# Altium project BatteryIot-V3.PrjPcb
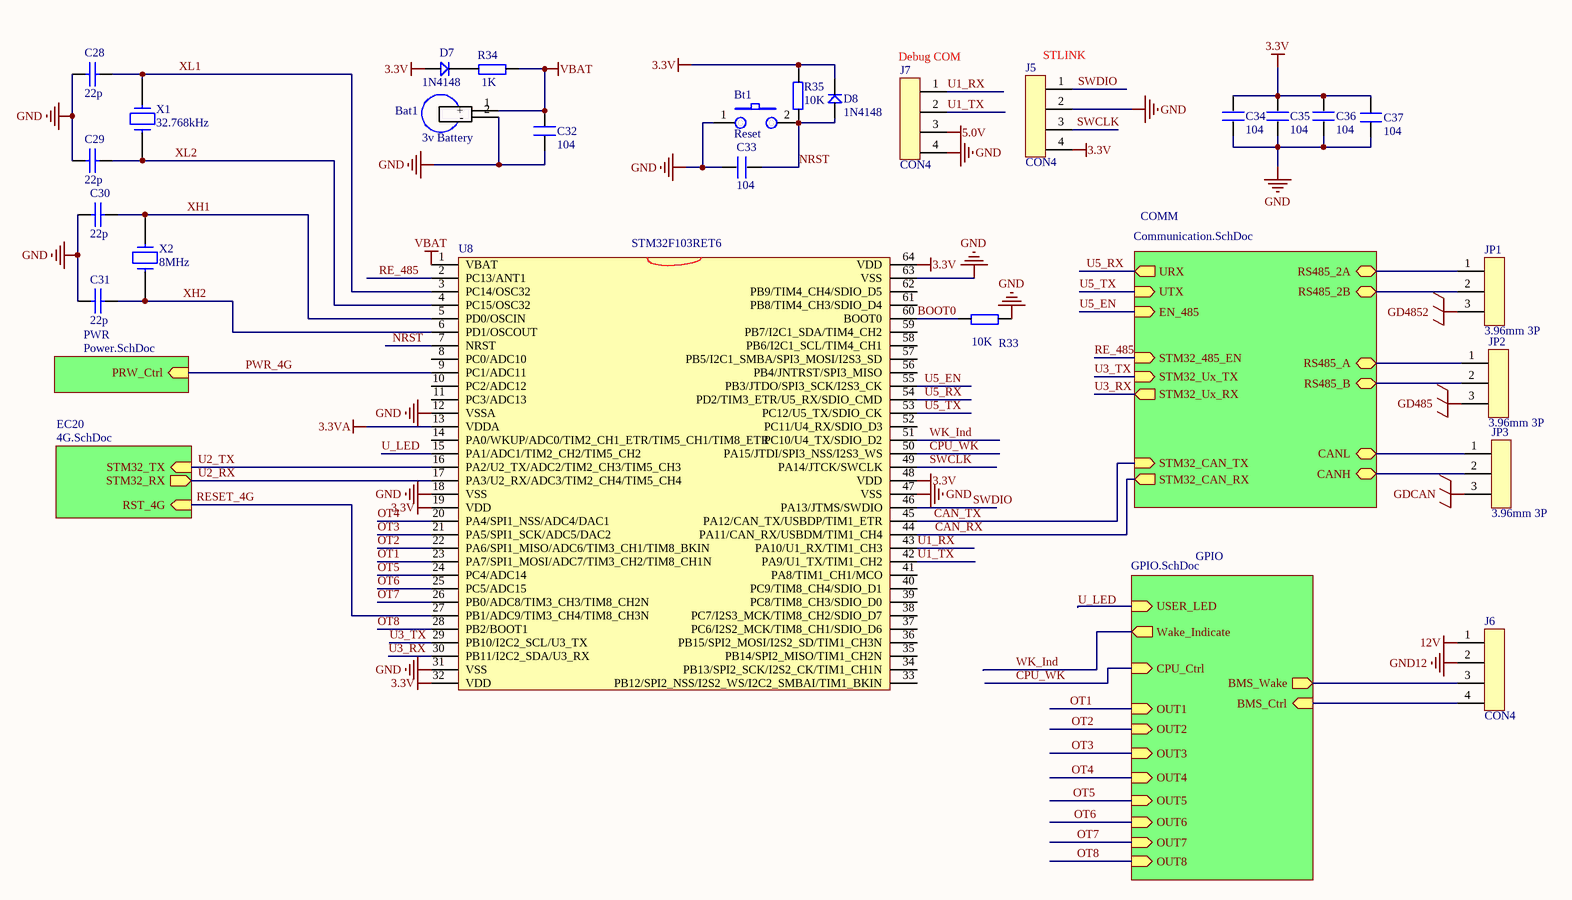
[diagram p0: TopLevelMCU.SchDoc]
5 sheets, 207 parts. Net scope: hierarchical (ports join the sheet entries above them; power ports are global).
Board files: BatteryIot.PcbDoc, BatteryIot -V2.PcbDoc, BatteryIot - 焊接图.PcbDoc
Sheets:
  TopLevelMCU.SchDoc
    EC20 = 4G.SchDoc
    GPIO = GPIO.SchDoc
    PWR = Power.SchDoc
    COMM = Communication.SchDoc

## Sheet TopLevelMCU.SchDoc
size A3

### Parts
Bat1  3v Battery  [BATM]
Bt1  Reset  [3*6*2.5贴片 微动开关]
C28  22p  [0603_C]
C29  22p  [0603_C]
C30  22p  [0603_C]
C31  22p  [0603_C]
C32  104  [0603_C]
C33  104  [0603_C]
C34  104  [0603_C]
C35  104  [0603_C]
C36  104  [0603_C]
C37  104  [0603_C]
D7  1N4148  [SOD-323]
D8  1N4148  [SOD-323]
J5  CON4  [CON4(2.54)]
J6  CON4  [CON4(2.54)]
J7  CON4  [CON4(2.54)]
JP1  3.96mm 3P
JP2  3.96mm 3P
JP3  3.96mm 3P
R33  10K  [0603_R]
R34  1K  [0603_R]
R35  10K  [0603_R]
U8  STM32F103RET6  [LQFP64]
X1  32.768kHz  [XTAL32]
X2  8MHz  [Crystal_SMD]

### Sub-sheets
COMM = Communication.SchDoc: STM32_485_EN (in), STM32_Ux_TX (in), STM32_Ux_RX (out), STM32_CAN_TX (in), CANH (bidir), RS485_B (bidir), CANL (bidir), RS485_A (bidir), STM32_CAN_RX (out), RS485_2A (bidir), RS485_2B (bidir), UTX (in), EN_485 (in), URX (out)
EC20 = 4G.SchDoc: STM32_RX (out), STM32_TX (in), RST_4G (in)
GPIO = GPIO.SchDoc: BMS_Ctrl (in), BMS_Wake (out), USER_LED (in), CPU_Ctrl (in), Wake_Indicate (out), OUT1 (in), OUT2 (in), OUT3 (in), OUT4 (in), OUT5 (in), OUT6 (in), OUT7 (in), OUT8 (in)
PWR = Power.SchDoc: PRW_Ctrl (in)

### Nets
3.3V: C34.1 C35.1 C36.1 C37.1 D7.1 D8.2 J5.4 R35.1 U8.19(VDD) U8.32(VDD) U8.48(VDD) U8.64(VDD)
3.3VA: U8.13(VDDA)
5.0V: J7.3
12V: J6.1
GD485: JP2.3
GD4852: JP1.3
GDCAN: JP3.3
GND: Bat1.2(-) Bt1.1 C28.2 C29.2 C30.2 C31.2 C32.2 C33.2 C34.2 C35.2 C36.2 C37.2 J5.2 J7.4 R33.2 U8.12(VSSA) U8.18(VSS) U8.31(VSS) U8.47(VSS) U8.63(VSS)
GND12: J6.2
VBAT: Bat1.1(+) C32.1 R34.2 U8.1(VBAT)
BOOT0: R33.1 U8.60(BOOT0)
C_N: JP3.1 ; sheet COMM/CANL
C_P: JP3.2 ; sheet COMM/CANH
CAN_RX: U8.44(PA11/CAN_RX/USBDM/TIM1_CH4) ; sheet COMM/STM32_CAN_RX
CAN_TX: U8.45(PA12/CAN_TX/USBDP/TIM1_ETR) ; sheet COMM/STM32_CAN_TX
CPU_WK: U8.50(PA15/JTDI/SPI3_NSS/I2S3_WS) ; sheet GPIO/CPU_Ctrl
NRST: Bt1.2 C33.1 D8.1 R35.2 U8.7(NRST)
OT1: U8.23(PA7/SPI1_MOSI/ADC7/TIM3_CH2/TIM8_CH1N) ; sheet GPIO/OUT1
OT2: U8.22(PA6/SPI1_MISO/ADC6/TIM3_CH1/TIM8_BKIN) ; sheet GPIO/OUT2
OT3: U8.21(PA5/SPI1_SCK/ADC5/DAC2) ; sheet GPIO/OUT3
OT4: U8.20(PA4/SPI1_NSS/ADC4/DAC1) ; sheet GPIO/OUT4
OT5: U8.24(PC4/ADC14) ; sheet GPIO/OUT5
OT6: U8.25(PC5/ADC15) ; sheet GPIO/OUT6
OT7: U8.26(PB0/ADC8/TIM3_CH3/TIM8_CH2N) ; sheet GPIO/OUT7
OT8: U8.28(PB2/BOOT1) ; sheet GPIO/OUT8
PWR_4G: U8.9(PC1/ADC11) ; sheet PWR/PRW_Ctrl
RE_485: U8.2(PC13/ANT1) ; sheet COMM/STM32_485_EN
RESET_4G: U8.27(PB1/ADC9/TIM3_CH4/TIM8_CH3N) ; sheet EC20/RST_4G
RS2_N: JP1.2 ; sheet COMM/RS485_2B
RS2_P: JP1.1 ; sheet COMM/RS485_2A
RS_N: JP2.2 ; sheet COMM/RS485_B
RS_P: JP2.1 ; sheet COMM/RS485_A
SWCLK: J5.3 U8.49(PA14/JTCK/SWCLK)
SWDIO: J5.1 U8.46(PA13/JTMS/SWDIO)
U1_RX: J7.1 U8.43(PA10/U1_RX/TIM1_CH3)
U1_TX: J7.2 U8.42(PA9/U1_TX/TIM1_CH2)
U2_RX: U8.17(PA3/U2_RX/ADC3/TIM2_CH4/TIM5_CH4) ; sheet EC20/STM32_RX  [project net TXD_4G]
U2_TX: U8.16(PA2/U2_TX/ADC2/TIM2_CH3/TIM5_CH3) ; sheet EC20/STM32_TX  [project net RXD_4G]
U3_RX: U8.30(PB11/I2C2_SDA/U3_RX) ; sheet COMM/STM32_Ux_RX
U3_TX: U8.29(PB10/I2C2_SCL/U3_TX) ; sheet COMM/STM32_Ux_TX
U5_EN: U8.55(PB3/JTDO/SPI3_SCK/I2S3_CK) ; sheet COMM/EN_485
U5_RX: U8.54(PD2/TIM3_ETR/U5_RX/SDIO_CMD) ; sheet COMM/URX
U5_TX: U8.53(PC12/U5_TX/SDIO_CK) ; sheet COMM/UTX
U_LED: U8.15(PA1/ADC1/TIM2_CH2/TIM5_CH2) ; sheet GPIO/USER_LED
WK_Ind: U8.51(PC10/U4_TX/SDIO_D2) ; sheet GPIO/Wake_Indicate
XH1: C30.1 U8.5(PD0/OSCIN) X2.1
XH2: C31.1 U8.6(PD1/OSCOUT) X2.2
XL1: C28.1 U8.3(PC14/OSC32) X1.1
XL2: C29.1 U8.4(PC15/OSC32) X1.2
NetC63_2: J6.3 ; sheet GPIO/BMS_Wake
NetD5_1: J6.4 ; sheet GPIO/BMS_Ctrl
NetD7_2: D7.2 R34.1

Not connected (* = marked no-connect by the designer): U8 8(PC0/ADC10) 10(PC2/ADC12) 11(PC3/ADC13) 14(PA0/WKUP/ADC0/TIM2_CH1_ETR/TIM5_CH1/TIM8_ETR) 33(PB12/SPI2_NSS/I2S2_WS/I2C2_SMBAI/TIM1_BKIN) 34(PB13/SPI2_SCK/I2S2_CK/TIM1_CH1N) 35(PB14/SPI2_MISO/TIM1_CH2N) 36(PB15/SPI2_MOSI/I2S2_SD/TIM1_CH3N) 37(PC6/I2S2_MCK/TIM8_CH1/SDIO_D6) 38(PC7/I2S3_MCK/TIM8_CH2/SDIO_D7) 39(PC8/TIM8_CH3/SDIO_D0) 40(PC9/TIM8_CH4/SDIO_D1) 41(PA8/TIM1_CH1/MCO) 52(PC11/U4_RX/SDIO_D3) 56(PB4/JNTRST/SPI3_MISO) 57(PB5/I2C1_SMBA/SPI3_MOSI/I2S3_SD) 58(PB6/I2C1_SCL/TIM4_CH1) 59(PB7/I2C1_SDA/TIM4_CH2) 61(PB8/TIM4_CH3/SDIO_D4) 62(PB9/TIM4_CH4/SDIO_D5)

### Notes on the sheet
- (near J7) Debug COM
- (near J5) STLINK

### Library data of the parts
Bat1 = MS621FE
Bt1 = PUSH BUTTON
C28-C31 = CAP: Capacitor
C32-C37 = C
D7 D8 = D
JP1-JP3 = CON3
R33-R35 = R
U8 = STM32F103RDT6
X1 X2 = Crystal2

## Sheet 4G.SchDoc
size A4
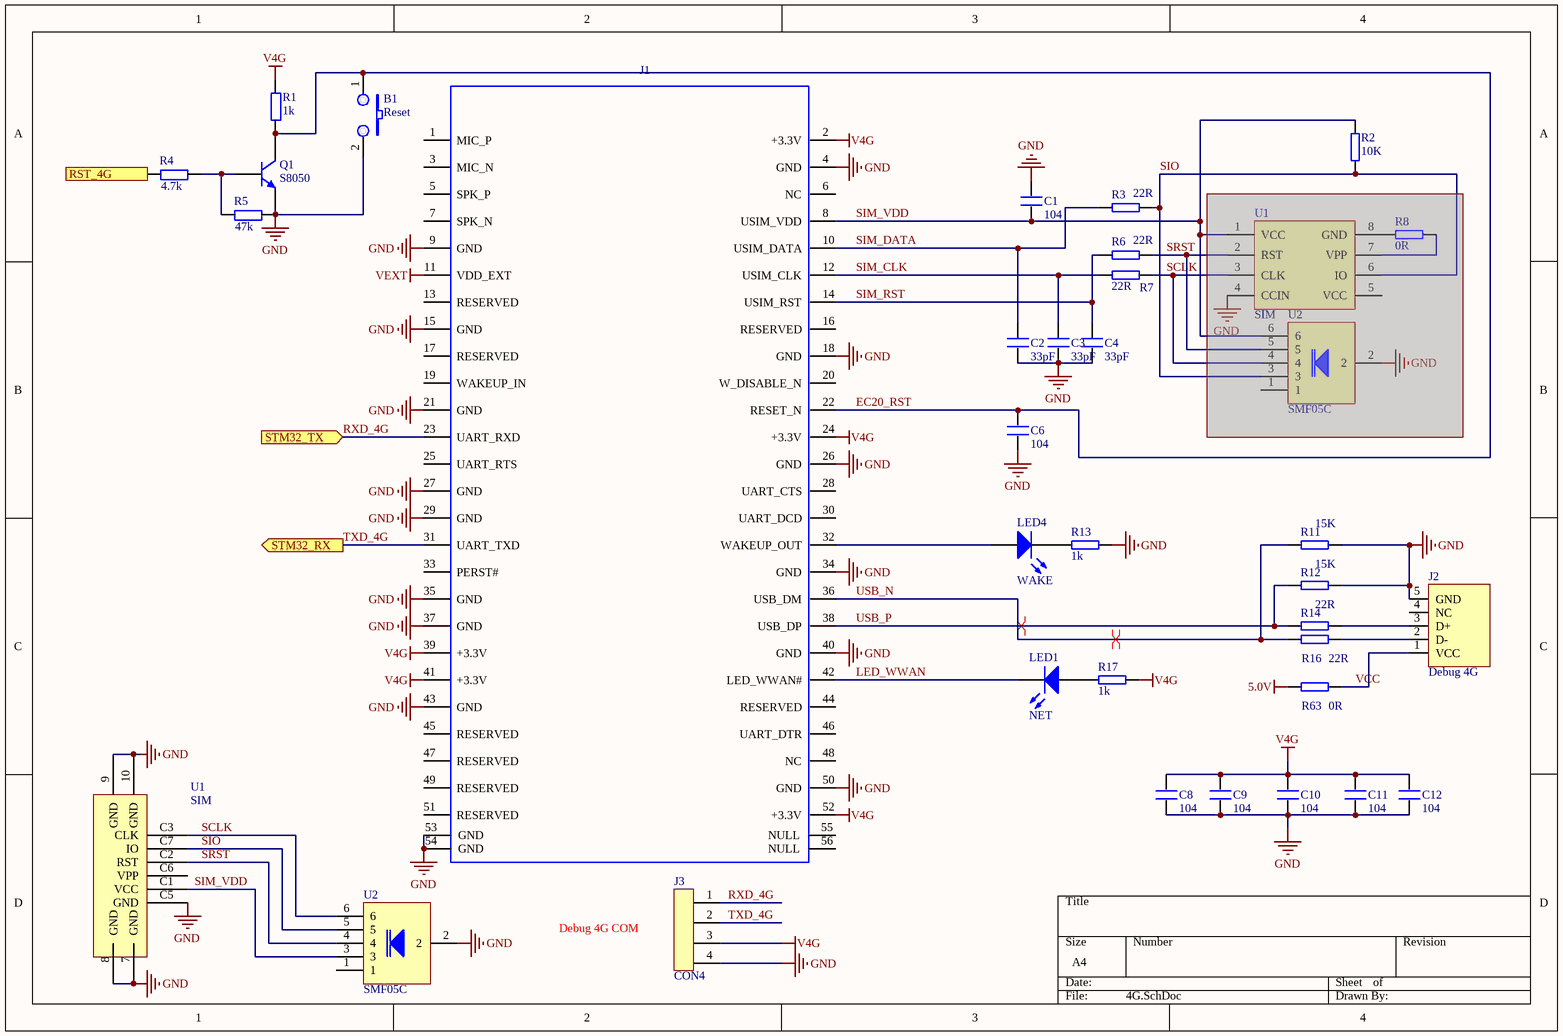
[diagram p1: 4G.SchDoc]

### Parts
(Parts that share a designator on the sheet are numbered #1, #2 ... from top to bottom, then left to right.)
B1  Reset  [3*6*2.5贴片 微动开关]
C1  104  [0603_C]
C2  33pF  [0603_C]
C3  33pF  [0603_C]
C4  33pF  [0603_C]
C6  104  [0603_C]
C8  104  [0603_C]
C9  104  [0603_C]
C10  104  [0603_C]
C11  104  [0603_C]
C12  104  [0603_C]
J1  MINI-PCIE-CON  [EC20_MINIPCI]  (value not drawn)
J2  Debug 4G  [USB_MINI_NEW]
J3  CON4  [CON4(2.54)]
LED1  NET  [LED]
LED4  WAKE  [LED]
Q1  S8050  [SOT-23]
R1  1k  [0603_R]
R2  10K  [0603_R]
R3  22R  [0603_R]
R4  4.7k  [0603_R]
R5  47k  [0603_R]
R6  22R  [0603_R]
R7  22R  [0603_R]
R8#1  0R  [0603_R]  (masked out: inside a compile mask, not in the netlist)
R11  15K  [0603_R]
R12  15K  [0603_R]
R13  1k  [0603_R]
R14  22R  [0603_R]
R16  22R  [0603_R]
R17  1k  [0603_R]
R63  0R  [0603_R]
U1#1  SIM  [SIM_BIG_POPUP]  (masked out: inside a compile mask, not in the netlist)
U1#2  SIM
U2#1  SMF05C  [SOT363]  (masked out: inside a compile mask, not in the netlist)
U2#2  SMF05C  [SOT363]

### Ports
RST_4G (in), STM32_RX (out), STM32_TX (in)

### Nets
5.0V: R63.2
GND: B1.2 C1.2 C2.2 C3.2 C4.2 C6.2 C8.2 C9.2 C10.2 C11.2 C12.2 J1.4(GND) J1.9(GND) J1.15(GND) J1.18(GND) J1.21(GND) J1.26(GND) J1.27(GND) J1.29(GND) J1.34(GND) J1.35(GND) J1.37(GND) J1.40(GND) J1.43(GND) J1.50(GND) J1.53(GND) J1.54(GND) J1.55(GND) J1.56(GND) J2.5(GND) J3.4 Q1.2 R5.2 R11.1 R12.1 R13.1 U1#2.7(GND) U1#2.8(GND) U1#2.9(GND) U1#2.10(GND) U1#2.C5(GND) U2#2.2
V4G: C8.1 C9.1 C10.1 C11.1 C12.1 J1.2(+3.3V) J1.24(+3.3V) J1.39(+3.3V) J1.41(+3.3V) J1.52(+3.3V) J3.3 R1.2 R17.1
VEXT: J1.11(VDD_EXT)
EC20_RST: B1.1 C6.1 J1.22(RESET_N) Q1.3 R1.1
LED_WWAN: J1.42(LED_WWAN#) LED1.2(K)
RESET_4G: R4.1 ; port RST_4G
RXD_4G: J1.23(UART_RXD) J3.1 ; port STM32_TX
SCLK: R7.1 U1#2.C3(CLK) U2#2.6
SIM_CLK: C3.1 J1.12(USIM_CLK) R7.2
SIM_DATA: C2.1 J1.10(USIM_DATA) R3.2
SIM_RST: C4.1 J1.14(USIM_RST) R6.2
SIM_VDD: C1.1 J1.8(USIM_VDD) R2.1 U1#2.C1(VCC) U2#2.3
SIO: R2.2 R3.1 U1#2.C7(IO) U2#2.5
SRST: R6.1 U1#2.C2(RST) U2#2.4
TXD_4G: J1.31(UART_TXD) J3.2 ; port STM32_RX
USB_N: J1.36(USB_DM) R11.2 R16.2
USB_P: J1.38(USB_DP) R12.2 R14.2
VCC: J2.1(VCC) R63.1
NetJ1_32: J1.32(WAKEUP_OUT) LED4.1(A)
NetJ2_2: J2.2(D-) R16.1
NetJ2_3: J2.3(D+) R14.1
NetLED1_1: LED1.1(A) R17.2
NetLED4_2: LED4.2(K) R13.2
NetQ1_1: Q1.1 R4.2 R5.1

Not connected (* = marked no-connect by the designer): J1 1(MIC_P) 3(MIC_N) 5(SPK_P) 6(NC) 7(SPK_N) 13(RESERVED) 16(RESERVED) 17(RESERVED) 19(WAKEUP_IN) 20(W_DISABLE_N) 25(UART_RTS) 28(UART_CTS) 30(UART_DCD) 33(PERST#) 44(RESERVED) 45(RESERVED) 46(UART_DTR) 47(RESERVED) 48(NC) 49(RESERVED) 51(RESERVED); J2 4(NC); U1#2 C6(VPP); U2#2 1

### Layout directives
differential pair: USB_N, USB_P

### Notes on the sheet
- Debug 4G COM

### Library data of the parts
B1 = PUSH BUTTON
C1-C4 C6 C8-C12 = C
J1 = MINI-PCIE-CON: Part Description: Mini PCIe; Value: Latch for Mini PCIe  4.0H 0.8MM pitch 52 circuit with cover lead-free; PCB DECAL: MINI-PCIE-CON
J2 = USB5
LED1 LED4 = LED2: Typical RED, GREEN, YELLOW, AMBER GaAs LED; Published: 8-Jun-2000; LatestRevisionDate: 17-Jul-2002; LatestRevisionNote: Re-released for DXP Platform.; PackageDocument: Feb-2002; PackageReference: 3.2X1.6X1.1; Publisher: Altium Limited
Q1 = NPN
R1 R4 R5 = R
R2 R3 R6 R7 R8#1 R11-R14 R16 R17 R63 = RES
U1#1 = SIM-抽屉式插卡
U1#2 = MicroSim: 6P自弹MICRO SIM卡座

## Sheet GPIO.SchDoc
size A4
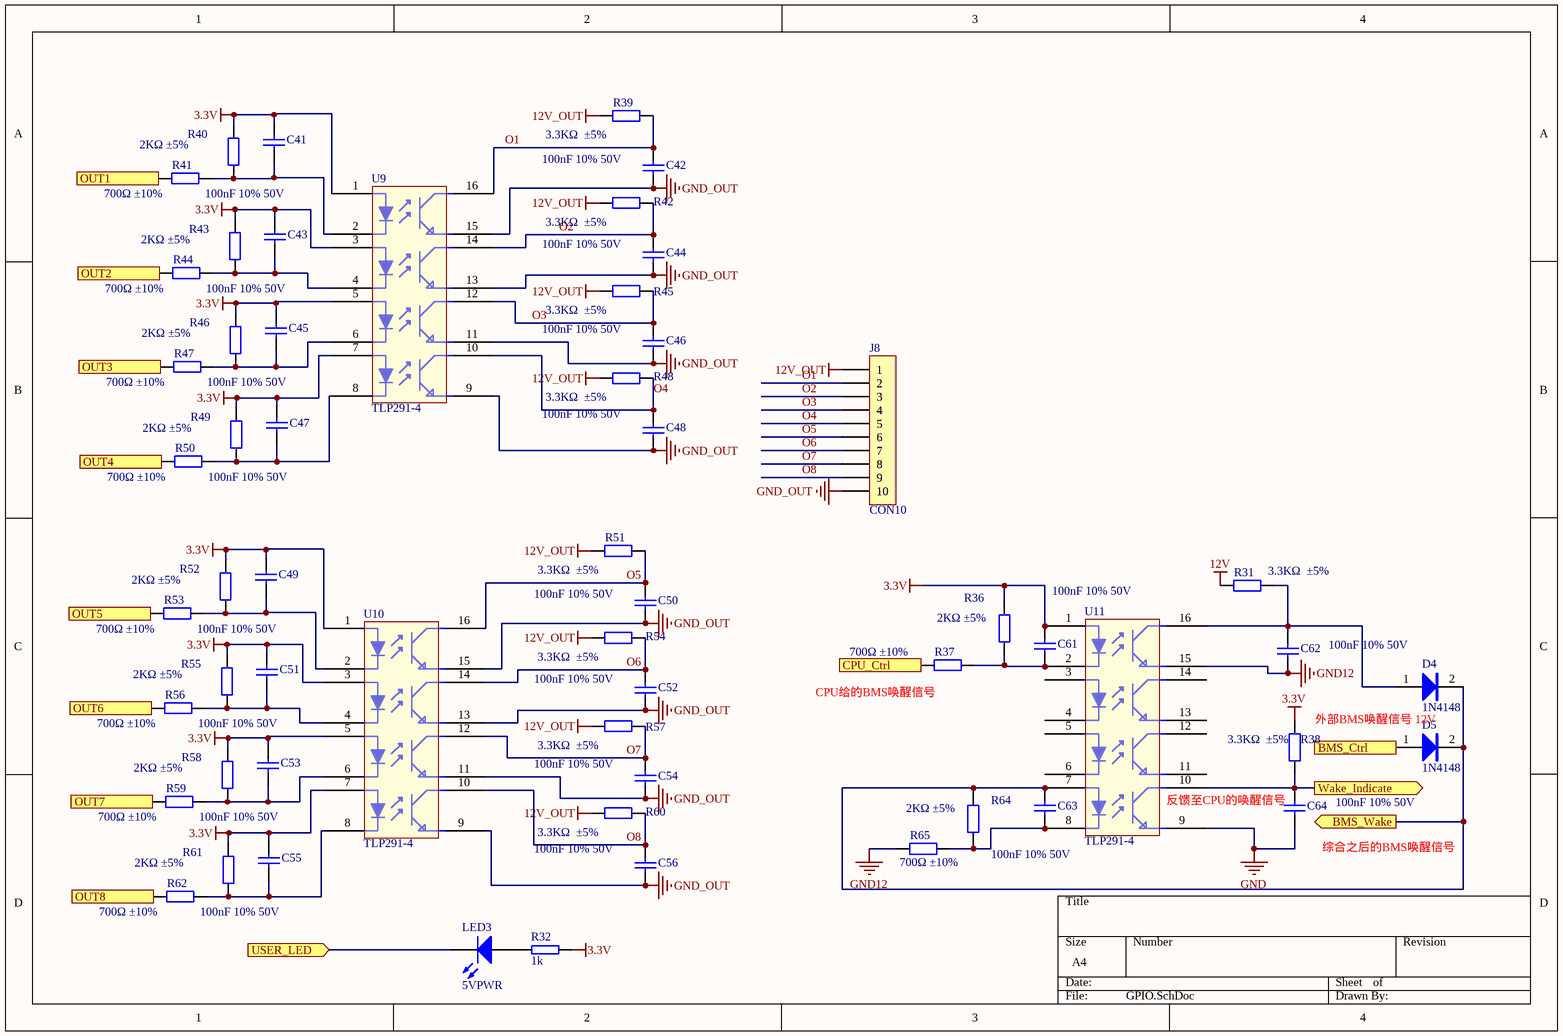
[diagram p2: GPIO.SchDoc]

### Parts
C41  100nF 10% 50V  [0603_C]
C42  100nF 10% 50V  [0603_C]
C43  100nF 10% 50V  [0603_C]
C44  100nF 10% 50V  [0603_C]
C45  100nF 10% 50V  [0603_C]
C46  100nF 10% 50V  [0603_C]
C47  100nF 10% 50V  [0603_C]
C48  100nF 10% 50V  [0603_C]
C49  100nF 10% 50V  [0603_C]
C50  100nF 10% 50V  [0603_C]
C51  100nF 10% 50V  [0603_C]
C52  100nF 10% 50V  [0603_C]
C53  100nF 10% 50V  [0603_C]
C54  100nF 10% 50V  [0603_C]
C55  100nF 10% 50V  [0603_C]
C56  100nF 10% 50V  [0603_C]
C61  100nF 10% 50V  [0603_C]
C62  100nF 10% 50V  [0603_C]
C63  100nF 10% 50V  [0603_C]
C64  100nF 10% 50V  [0603_C]
D4  1N4148  [SOD-323]
D5  1N4148  [SOD-323]
J8  CON10  [XH2.54-SMD-5*2P]
LED3  5VPWR  [LED]
R31  3.3KΩ  ±5%  [0603_R]
R32  1k  [0603_R]
R36  2KΩ ±5%  [0603_R]
R37  700Ω ±10%  [0603_R]
R38  3.3KΩ  ±5%  [0603_R]
R39  3.3KΩ  ±5%  [0603_R]
R40  2KΩ ±5%  [0603_R]
R41  700Ω ±10%  [0603_R]
R42  3.3KΩ  ±5%  [0603_R]
R43  2KΩ ±5%  [0603_R]
R44  700Ω ±10%  [0603_R]
R45  3.3KΩ  ±5%  [0603_R]
R46  2KΩ ±5%  [0603_R]
R47  700Ω ±10%  [0603_R]
R48  3.3KΩ  ±5%  [0603_R]
R49  2KΩ ±5%  [0603_R]
R50  700Ω ±10%  [0603_R]
R51  3.3KΩ  ±5%  [0603_R]
R52  2KΩ ±5%  [0603_R]
R53  700Ω ±10%  [0603_R]
R54  3.3KΩ  ±5%  [0603_R]
R55  2KΩ ±5%  [0603_R]
R56  700Ω ±10%  [0603_R]
R57  3.3KΩ  ±5%  [0603_R]
R58  2KΩ ±5%  [0603_R]
R59  700Ω ±10%  [0603_R]
R60  3.3KΩ  ±5%  [0603_R]
R61  2KΩ ±5%  [0603_R]
R62  700Ω ±10%  [0603_R]
R64  2KΩ ±5%  [0603_R]
R65  700Ω ±10%  [0603_R]
U9  TLP291-4  [SOP16_M]
U10  TLP291-4  [SOP16_M]
U11  TLP291-4  [SOP16_M]

### Ports
BMS_Ctrl (in), BMS_Wake (out), CPU_Ctrl (in), OUT1 (in), OUT2 (in), OUT3 (in), OUT4 (in), OUT5 (in), OUT6 (in), OUT7 (in), OUT8 (in), USER_LED (in), Wake_Indicate (out)

### Nets
3.3V: C41.2 C43.2 C45.2 C47.2 C49.2 C51.2 C53.2 C55.2 C61.2 R32.1 R36.2 R38.1 R40.2 R43.2 R46.2 R49.2 R52.2 R55.2 R58.2 R61.2 U9.1(INPUT-A) U9.3(EMITTER) U9.5 U9.7 U10.1(INPUT-A) U10.3(EMITTER) U10.5 U10.7 U11.1(INPUT-A)
12V: R31.2
12V_OUT: J8.1 R39.2 R42.2 R45.2 R48.2 R51.2 R54.2 R57.2 R60.2
GND: C64.1 U11.9
GND12: C62.1 R65.1 U11.15
GND_OUT: C42.1 C44.1 C46.1 C48.1 C50.1 C52.1 C54.1 C56.1 J8.10 U9.9 U9.11 U9.13 U9.15 U10.9 U10.11 U10.13 U10.15
CPU_WK: R37.1 ; port CPU_Ctrl
O1: C42.2 J8.2 R39.1 U9.16
O2: C44.2 J8.3 R42.1 U9.14
O3: C46.2 J8.4 R45.1 U9.12
O4: C48.2 J8.5 R48.1 U9.10
O5: C50.2 J8.6 R51.1 U10.16
O6: C52.2 J8.7 R54.1 U10.14
O7: C54.2 J8.8 R57.1 U10.12
O8: C56.2 J8.9 R60.1 U10.10
OT1: R41.1 ; port OUT1
OT2: R44.1 ; port OUT2
OT3: R47.1 ; port OUT3
OT4: R50.1 ; port OUT4
OT5: R53.1 ; port OUT5
OT6: R56.1 ; port OUT6
OT7: R59.1 ; port OUT7
OT8: R62.1 ; port OUT8
U_LED: LED3.2(K) ; port USER_LED
WK_Ind: C64.2 R38.2 U11.10 ; port Wake_Indicate
NetC41_1: C41.1 R40.1 R41.2 U9.2(INPUT-K)
NetC43_1: C43.1 R43.1 R44.2 U9.4(COLLECTOR)
NetC45_1: C45.1 R46.1 R47.2 U9.6
NetC47_1: C47.1 R49.1 R50.2 U9.8
NetC49_1: C49.1 R52.1 R53.2 U10.2(INPUT-K)
NetC51_1: C51.1 R55.1 R56.2 U10.4(COLLECTOR)
NetC53_1: C53.1 R58.1 R59.2 U10.6
NetC55_1: C55.1 R61.1 R62.2 U10.8
NetC61_1: C61.1 R36.1 R37.2 U11.2(INPUT-K)
NetC62_2: C62.2 D4.1 R31.1 U11.16
NetC63_1: C63.1 R64.1 R65.2 U11.8
NetC63_2: C63.2 D4.2 D5.2 R64.2 U11.7 ; port BMS_Wake
NetD5_1: D5.1 ; port BMS_Ctrl
NetLED3_1: LED3.1(A) R32.2

Not connected (* = marked no-connect by the designer): U11 3(EMITTER) 4(COLLECTOR) 5 6 11 12 13 14

### Notes on the sheet
- (near R37) CPU给的BMS唤醒信号
- 外部BMS唤醒信号 12V
- (near U11) 反馈至CPU的唤醒信号
- (near C64) 综合之后的BMS唤醒信号

### Library data of the parts
C41-C56 C61-C64 = 0603 1nF (102) 10% 50V: 贴片电容; ComponentLink1Description: 供应商链接; ComponentLink1URL: http://www.szlcsc.com/product/details_1940.html; Package: 0603; Supplier: LC; SuppliersPartNumber: C1588
D4 D5 = SS34
LED3 = LED2: as LED1 on sheet 4G; Published: 8-Jun-2000; LatestRevisionDate: 17-Jul-2002; LatestRevisionNote: Re-released for DXP Platform.; PackageDocument: Feb-2002; PackageReference: 3.2X1.6X1.1; Publisher: Altium Limited
R31 R38 R39 R42 R45 R48 R51 R54 R57 R60 = 0603 3.3KΩ (3301) 1%: 贴片电阻; ComponentLink1Description: 供应商链接; ComponentLink1URL: http://www.szlcsc.com/product/details_23705.html; Package: 0603; Supplier: LC; SuppliersPartNumber: C22978
R32 = RES
R36 R40 R43 R46 R49 R52 R55 R58 R61 R64 = 0603 2KΩ (2001) 1%: 贴片电阻; ComponentLink1Description: 供应商链接; ComponentLink1URL: http://www.szlcsc.com/product/details_23702.html; Package: 0603; Supplier: LC; SuppliersPartNumber: C22975
R37 R41 R44 R47 R50 R53 R56 R59 R62 R65 = 0603 5.6KΩ (5601) 1%: 贴片电阻; ComponentLink1Description: 供应商链接; ComponentLink1URL: http://www.szlcsc.com/product/details_23916.html; Package: 0603; Supplier: LC; SuppliersPartNumber: C23189
U9-U11 = PS2801: 东芝四通道光耦 SOP16

## Sheet Power.SchDoc
size A4
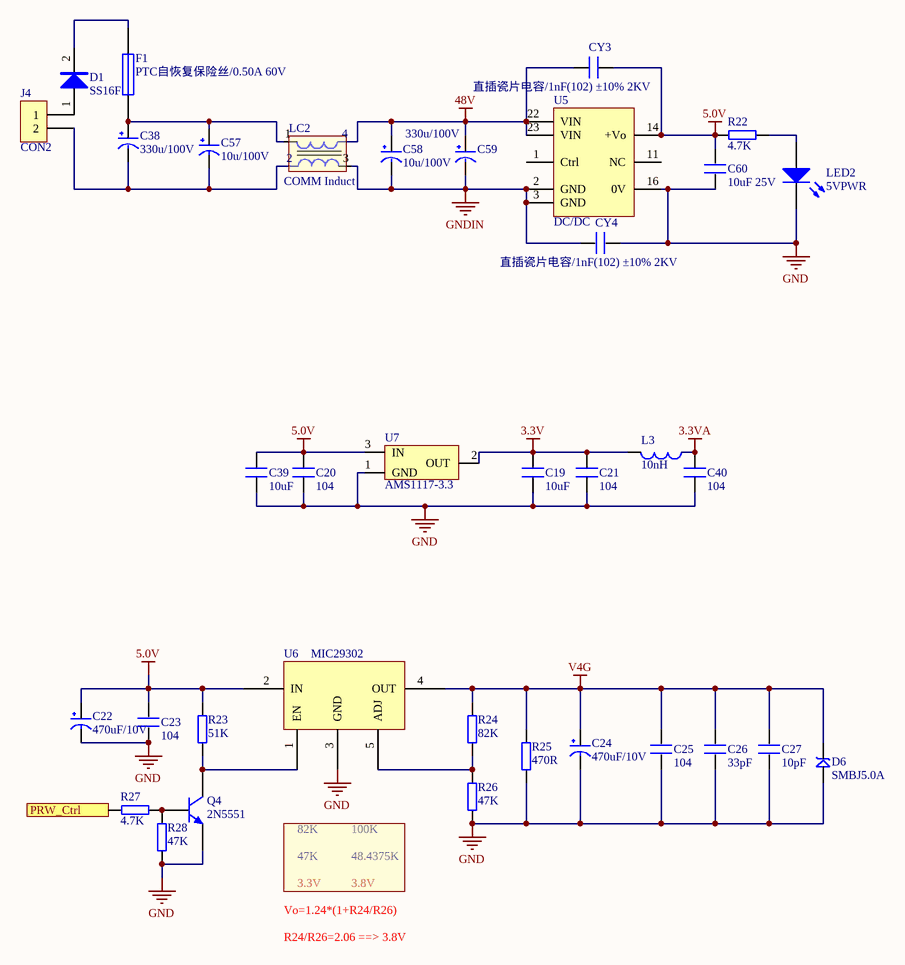
[diagram p3: Power.SchDoc]

### Parts
C19  10uF  [1206_C]
C20  104  [0603_C]
C21  104  [0603_C]
C22  470uF/10V  [SMD-CT-7343]
C23  104  [0603_C]
C24  470uF/10V  [SMD-CT-7343]
C25  104  [0603_C]
C26  33pF  [0603_C]
C27  10pF  [0603_C]
C38  330u/100V  [SMD-CT-7343]
C39  10uF  [1206_C]
C40  104  [0603_C]
C57  10u/100V  [SMD-CT-7343]
C58  10u/100V  [SMD-CT-7343]
C59  330u/100V  [SMD-CT-7343]
C60  10uF 25V  [1206_C]
CY3  直插瓷片电容/1nF(102) ±10% 2KV  [1206_C]
CY4  直插瓷片电容/1nF(102) ±10% 2KV  [1206_C]
D1  SS16F  [SMB(DO-214AA)_S1]
D6  SMBJ5.0A  [SMB(DO-214AA)_S1]
F1  PTC自恢复保险丝/0.50A 60V  [PIN-W2/E2.8]
J4  CON2  [CON5.08-2P]
L3  10nH  [0805_L]
LC2  COMM Induct
LED2  5VPWR  [SMDLED]
Q4  2N5551  [SOT-23]
R22  4.7K  [0603_R]
R23  51K  [0603_R]
R24  82K  [0603_R]
R25  470R  [1206_R]
R26  47K  [0603_R]
R27  4.7K  [0603_R]
R28  47K  [0603_R]
U5  DC/DC
U6  MIC29302  [TO-263-5-NEW]
U7  AMS1117-3.3  [SOT-223]

### Ports
PRW_Ctrl (in)

### Nets
3.3V: C19.1 C21.1 L3.1 U7.2(OUT)
3.3VA: C40.1 L3.2
5.0V: C20.1 C22.1(VCC) C23.1 C39.2 C60.1 CY3.2 R22.2 R23.2 U5.14(+Vo) U6.2(IN) U7.3(IN)
48V: C58.1(VCC) C59.1(VCC) CY3.1 LC2.4 U5.22(VIN) U5.23(VIN)
GND: C19.2 C20.2 C21.2 C22.2(GND) C23.2 C24.2(GND) C25.2 C26.2 C27.2 C39.1 C40.2 C60.2 CY4.2 D6.1 LED2.2(K) Q4.2 R25.1 R26.1 R28.1 U5.16(0V) U6.3(GND) U7.1(GND)
GNDIN: C58.2(GND) C59.2(GND) CY4.1 LC2.3 U5.2(GND) U5.3(GND)
V4G: C24.1(VCC) C25.1 C26.1 C27.1 D6.2 R24.2 R25.2 U6.4(OUT)
PWR_4G: R27.2 ; port PRW_Ctrl
NetC38_1: C38.1(VCC) C57.1(VCC) F1.1 LC2.1
NetC38_2: C38.2(GND) C57.2(GND) J4.2 LC2.2
NetD1_1: D1.1 J4.1
NetD1_2: D1.2 F1.2
NetLED2_1: LED2.1(A) R22.1
NetQ4_1: Q4.1 R27.1 R28.2
NetQ4_3: Q4.3 R23.1 U6.1(EN)
NetR24_1: R24.1 R26.2 U6.5(ADJ)

Not connected (* = marked no-connect by the designer): U5 1(Ctrl) 11(NC)

### Notes on the sheet
- 82K
- 47K
- 3.3V
- 100K
- 48.4375K
- 3.8V
- Vo=1.24*(1+R24/R26)
- R24/R26=2.06 ==> 3.8V

### Library data of the parts
C19-C21 C23 C25-C27 C39 C40 CY3 CY4 = C
C22 C24 C38 C57-C59 = CAP
C60 = C: 0805
D1 = SS34
D6 = SMBJ: TVS
F1 = Fuse 1: Fuse; Published: 8-Jun-2000; LatestRevisionDate: 17-Jul-2002; LatestRevisionNote: Re-released for DXP Platform.; PackageReference: PIN-W2/E2.8; Publisher: Altium Limited; PackageDescription: Thru-Hole; 2 Leads
L3 = L
LC2 = FL2D-Z5-103
LED2 = LED2: as LED1 on sheet 4G; Published: 8-Jun-2000; LatestRevisionDate: 17-Jul-2002; LatestRevisionNote: Re-released for DXP Platform.; PackageDocument: Feb-2002; PackageReference: 3.2X1.6X1.1; Publisher: Altium Limited
Q4 = NPN
R22-R28 = RES
U5 = VRB4805ZP-10WR3
U6 = MIC29302WU
U7 = AMS1117

## Sheet Communication.SchDoc
size A4
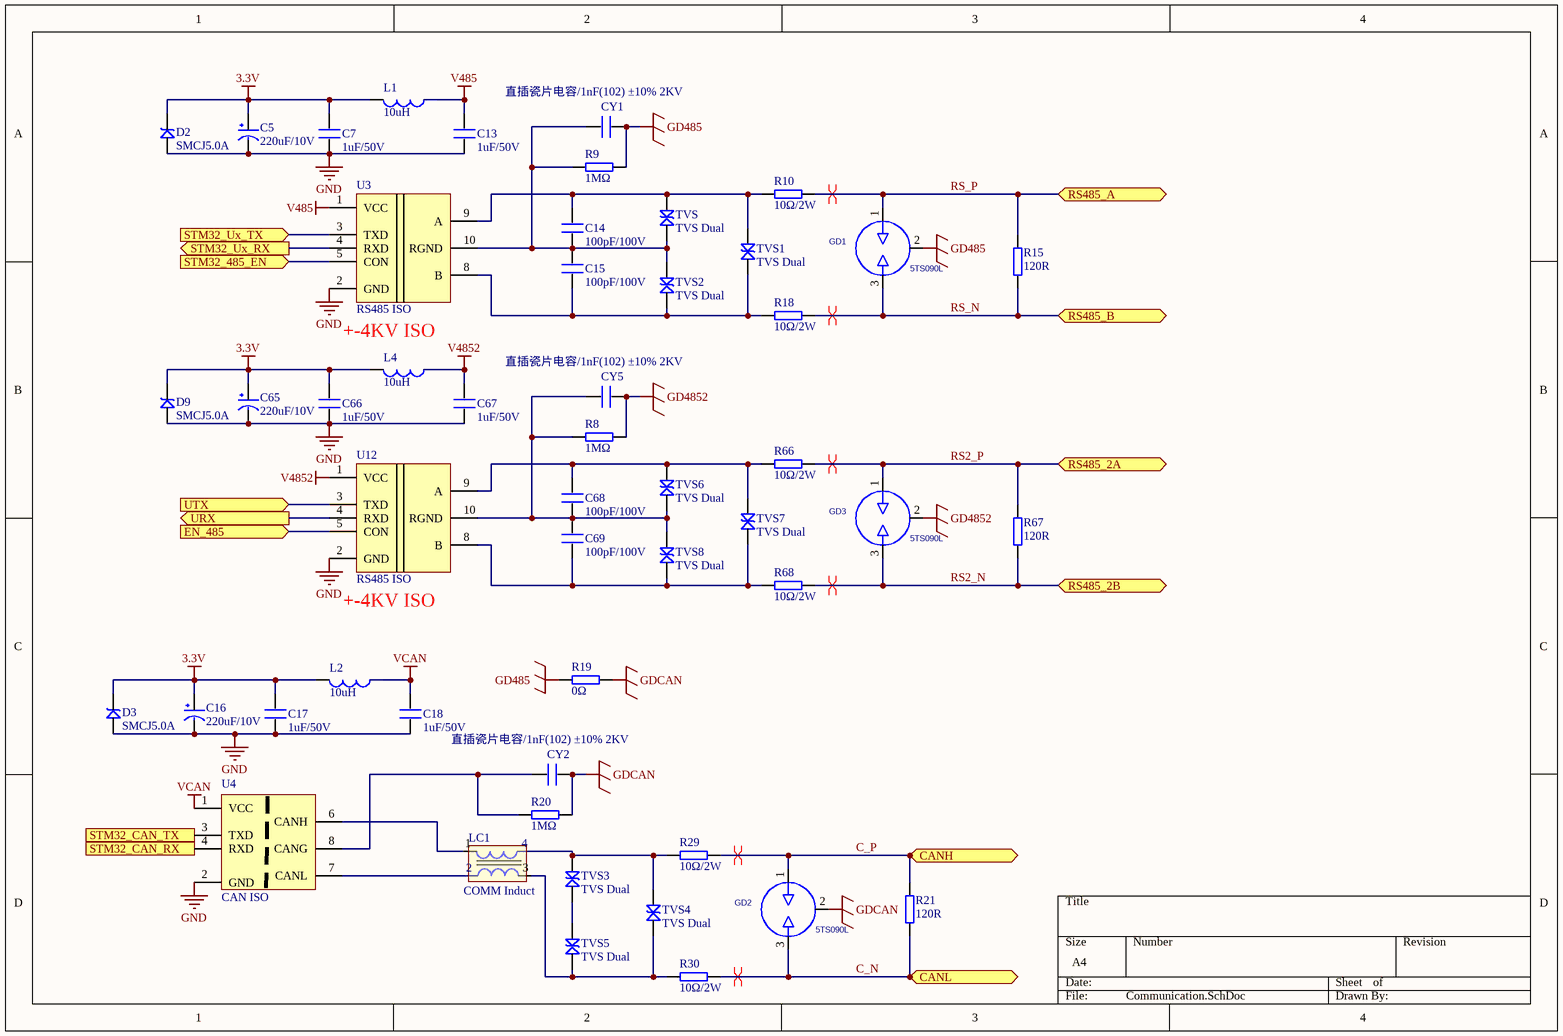
[diagram p4: Communication.SchDoc]

### Parts
(Parts that share a designator on the sheet are numbered #1, #2 ... from top to bottom, then left to right.)
C5  220uF/10V  [SMD-CT-7343]
C7  1uF/50V  [0603_C]
C13  1uF/50V  [0603_C]
C14  100pF/100V  [0603_C]
C15  100pF/100V  [0603_C]
C16  220uF/10V  [SMD-CT-7343]
C17  1uF/50V  [0603_C]
C18  1uF/50V  [0603_C]
C65  220uF/10V  [SMD-CT-7343]
C66  1uF/50V  [0603_C]
C67  1uF/50V  [0603_C]
C68  100pF/100V  [0603_C]
C69  100pF/100V  [0603_C]
CY1  直插瓷片电容/1nF(102) ±10% 2KV  [1206_C]
CY2  直插瓷片电容/1nF(102) ±10% 2KV  [1206_C]
CY5  直插瓷片电容/1nF(102) ±10% 2KV  [1206_C]
D2  SMCJ5.0A  [SMB(DO-214AA)_S1]
D3  SMCJ5.0A  [SMB(DO-214AA)_S1]
D9  SMCJ5.0A  [SMB(DO-214AA)_S1]
GD1  5TS090L  [T83-A90X]
GD2  5TS090L  [T83-A90X]
GD3  5TS090L  [T83-A90X]
L1  10uH  [0805_L]
L2  10uH  [0805_L]
L4  10uH  [0805_L]
LC1  COMM Induct
R8#2  1MΩ  [0603_R]
R9  1MΩ  [0603_R]
R10  10Ω/2W  [0603_R]
R15  120R  [0603_R]
R18  10Ω/2W  [0603_R]
R19  0Ω  [0603_R]
R20  1MΩ  [0603_R]
R21  120R  [0603_R]
R29  10Ω/2W  [0603_R]
R30  10Ω/2W  [0603_R]
R66  10Ω/2W  [0603_R]
R67  120R  [0603_R]
R68  10Ω/2W  [0603_R]
TVS  TVS Dual
TVS1  TVS Dual
TVS2  TVS Dual
TVS3  TVS Dual
TVS4  TVS Dual
TVS5  TVS Dual
TVS6  TVS Dual
TVS7  TVS Dual
TVS8  TVS Dual
U3  RS485 ISO
U4  CAN ISO
U12  RS485 ISO

### Ports
CANH (bidir), CANL (bidir), EN_485 (in), RS485_2A (bidir), RS485_2B (bidir), RS485_A (bidir), RS485_B (bidir), STM32_485_EN (in), STM32_CAN_RX (out), STM32_CAN_TX (in), STM32_Ux_RX (out), STM32_Ux_TX (in), URX (out), UTX (in)

### Nets
3.3V: C5.1(VCC) C7.2 C16.1(VCC) C17.2 C65.1(VCC) C66.2 D2.2 D3.2 D9.2 L1.1 L2.1 L4.1
GD485: CY1.2 GD1.2 R9.1 R19.1
GD4852: CY5.2 GD3.2 R8#2.1
GDCAN: CY2.2 GD2.2 R19.2 R20.1
GND: C5.2(GND) C7.1 C13.1 C16.2(GND) C17.1 C18.1 C65.2(GND) C66.1 C67.1 D2.1 D3.1 D9.1 U3.2(GND) U4.2(GND) U12.2(GND)
V485: C13.2 L1.2 U3.1(VCC)
V4852: C67.2 L4.2 U12.1(VCC)
VCAN: C18.2 L2.2 U4.1(VCC)
C_N: GD2.3 R21.1 R30.1 ; port CANL
C_P: GD2.1 R21.2 R29.1 ; port CANH
CAN_RX: U4.4(RXD) ; port STM32_CAN_RX
CAN_TX: U4.3(TXD) ; port STM32_CAN_TX
RE_485: U3.5(CON) ; port STM32_485_EN
RS2_N: GD3.3 R67.1 R68.1 ; port RS485_2B
RS2_P: GD3.1 R66.1 R67.2 ; port RS485_2A
RS_N: GD1.3 R15.1 R18.1 ; port RS485_B
RS_P: GD1.1 R10.1 R15.2 ; port RS485_A
U3_RX: U3.4(RXD) ; port STM32_Ux_RX
U3_TX: U3.3(TXD) ; port STM32_Ux_TX
U5_EN: U12.5(CON) ; port EN_485
U5_RX: U12.4(RXD) ; port URX
U5_TX: U12.3(TXD) ; port UTX
NetC14_1: C14.1 C15.2 CY1.1 R9.2 TVS.1 TVS2.2 U3.10(RGND)
NetC14_2: C14.2 R10.2 TVS.2 TVS1.2 U3.9(A)
NetC15_1: C15.1 R18.2 TVS1.1 TVS2.1 U3.8(B)
NetC68_1: C68.1 C69.2 CY5.1 R8#2.2 TVS6.1 TVS8.2 U12.10(RGND)
NetC68_2: C68.2 R66.2 TVS6.2 TVS7.2 U12.9(A)
NetC69_1: C69.1 R68.2 TVS7.1 TVS8.1 U12.8(B)
NetCY2_1: CY2.1 R20.2 U4.8(CANG)
NetLC1_1: LC1.1 U4.6(CANH)
NetLC1_2: LC1.2 U4.7(CANL)
NetLC1_3: LC1.3 R30.2 TVS4.1 TVS5.1
NetLC1_4: LC1.4 R29.2 TVS3.2 TVS4.2
NetTVS3_1: TVS3.1 TVS5.2

### Layout directives
differential pair: C_N, C_P, RS2_N, RS2_P, RS_N, RS_P

### Notes on the sheet
- +-4KV ISO
- (near U12) +-4KV ISO

### Library data of the parts
C5 C16 C65 = CAP: 电解电容
C7 C13-C15 C17 C18 C66-C69 CY1 CY2 CY5 = C
D2 D3 D9 = SMBJ: TVS
GD1-GD3 = EZ3-A90X_0: 气体放电管; 项目描述: 三极浪涌吸收避雷器-90V; 项目编码: 22020002; 生产厂家: EPCOS; 厂家型号: EZ3-A90X; 供应商1: EPCOS; 供应商2: /
L1 L2 L4 = L
LC1 = FL2D-Z5-103
R8#2 R9 R15 R19-R21 R67 = RES
R10 R18 R29 R30 R66 R68 = RES: 绕线电阻
TVS TVS1-TVS8 = TVS2
U3 U12 = TD301D485
U4 = TD301DCAN

## Nets that join several sheets
3.3V: TopLevelMCU (12 pins), GPIO (29 pins), Power (C19.1 C21.1 L3.1 U7.2), Communication (12 pins)
3.3VA: TopLevelMCU (U8.13), Power (C40.1 L3.2)
5.0V: TopLevelMCU (J7.3), 4G (R63.2), Power (11 pins)
12V: TopLevelMCU (J6.1), GPIO (R31.2)
GD485: TopLevelMCU (JP2.3), Communication (CY1.2 GD1.2 R9.1 R19.1)
GD4852: TopLevelMCU (JP1.3), Communication (CY5.2 GD3.2 R8#2.1)
GDCAN: TopLevelMCU (JP3.3), Communication (CY2.2 GD2.2 R19.2 R20.1)
GND: TopLevelMCU (20 pins), 4G (42 pins), GPIO (C64.1 U11.9), Power (22 pins), Communication (15 pins)
GND12: TopLevelMCU (J6.2), GPIO (C62.1 R65.1 U11.15)
V4G: 4G (13 pins), Power (8 pins)
C_N: TopLevelMCU (JP3.1), Communication (GD2.3 R21.1 R30.1)
C_P: TopLevelMCU (JP3.2), Communication (GD2.1 R21.2 R29.1)
CAN_RX: TopLevelMCU (U8.44), Communication (U4.4)
CAN_TX: TopLevelMCU (U8.45), Communication (U4.3)
CPU_WK: TopLevelMCU (U8.50), GPIO (R37.1)
NetC63_2: TopLevelMCU (J6.3), GPIO (5 pins)
NetD5_1: TopLevelMCU (J6.4), GPIO (D5.1)
OT1: TopLevelMCU (U8.23), GPIO (R41.1)
OT2: TopLevelMCU (U8.22), GPIO (R44.1)
OT3: TopLevelMCU (U8.21), GPIO (R47.1)
OT4: TopLevelMCU (U8.20), GPIO (R50.1)
OT5: TopLevelMCU (U8.24), GPIO (R53.1)
OT6: TopLevelMCU (U8.25), GPIO (R56.1)
OT7: TopLevelMCU (U8.26), GPIO (R59.1)
OT8: TopLevelMCU (U8.28), GPIO (R62.1)
PWR_4G: TopLevelMCU (U8.9), Power (R27.2)
RE_485: TopLevelMCU (U8.2), Communication (U3.5)
RESET_4G: TopLevelMCU (U8.27), 4G (R4.1)
RS2_N: TopLevelMCU (JP1.2), Communication (GD3.3 R67.1 R68.1)
RS2_P: TopLevelMCU (JP1.1), Communication (GD3.1 R66.1 R67.2)
RS_N: TopLevelMCU (JP2.2), Communication (GD1.3 R15.1 R18.1)
RS_P: TopLevelMCU (JP2.1), Communication (GD1.1 R10.1 R15.2)
RXD_4G: TopLevelMCU (U8.16), 4G (J1.23 J3.1)
TXD_4G: TopLevelMCU (U8.17), 4G (J1.31 J3.2)
U3_RX: TopLevelMCU (U8.30), Communication (U3.4)
U3_TX: TopLevelMCU (U8.29), Communication (U3.3)
U5_EN: TopLevelMCU (U8.55), Communication (U12.5)
U5_RX: TopLevelMCU (U8.54), Communication (U12.4)
U5_TX: TopLevelMCU (U8.53), Communication (U12.3)
U_LED: TopLevelMCU (U8.15), GPIO (LED3.2)
WK_Ind: TopLevelMCU (U8.51), GPIO (C64.2 R38.2 U11.10)